# Altium project Power_Suply.PrjPcb
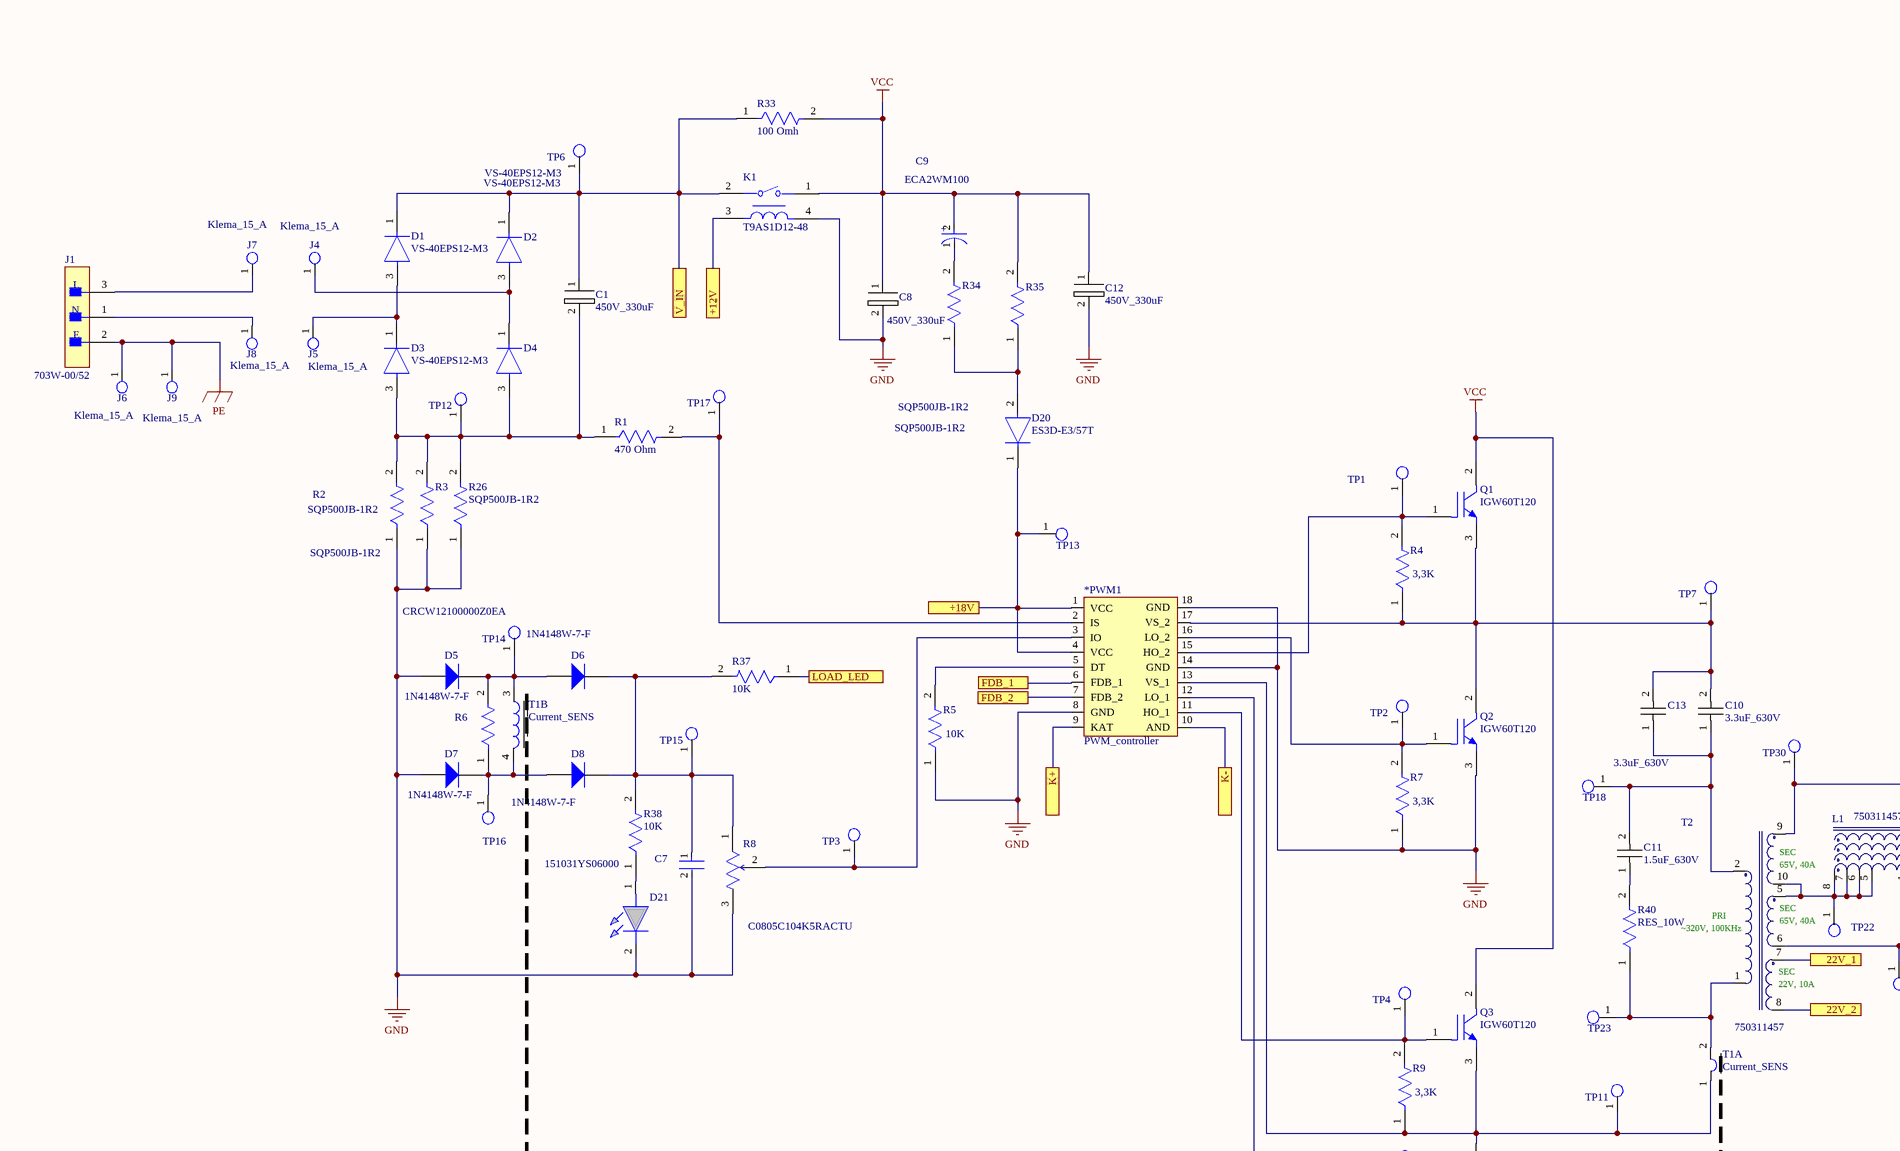
[diagram p0: Sheet1.SchDoc, top left]
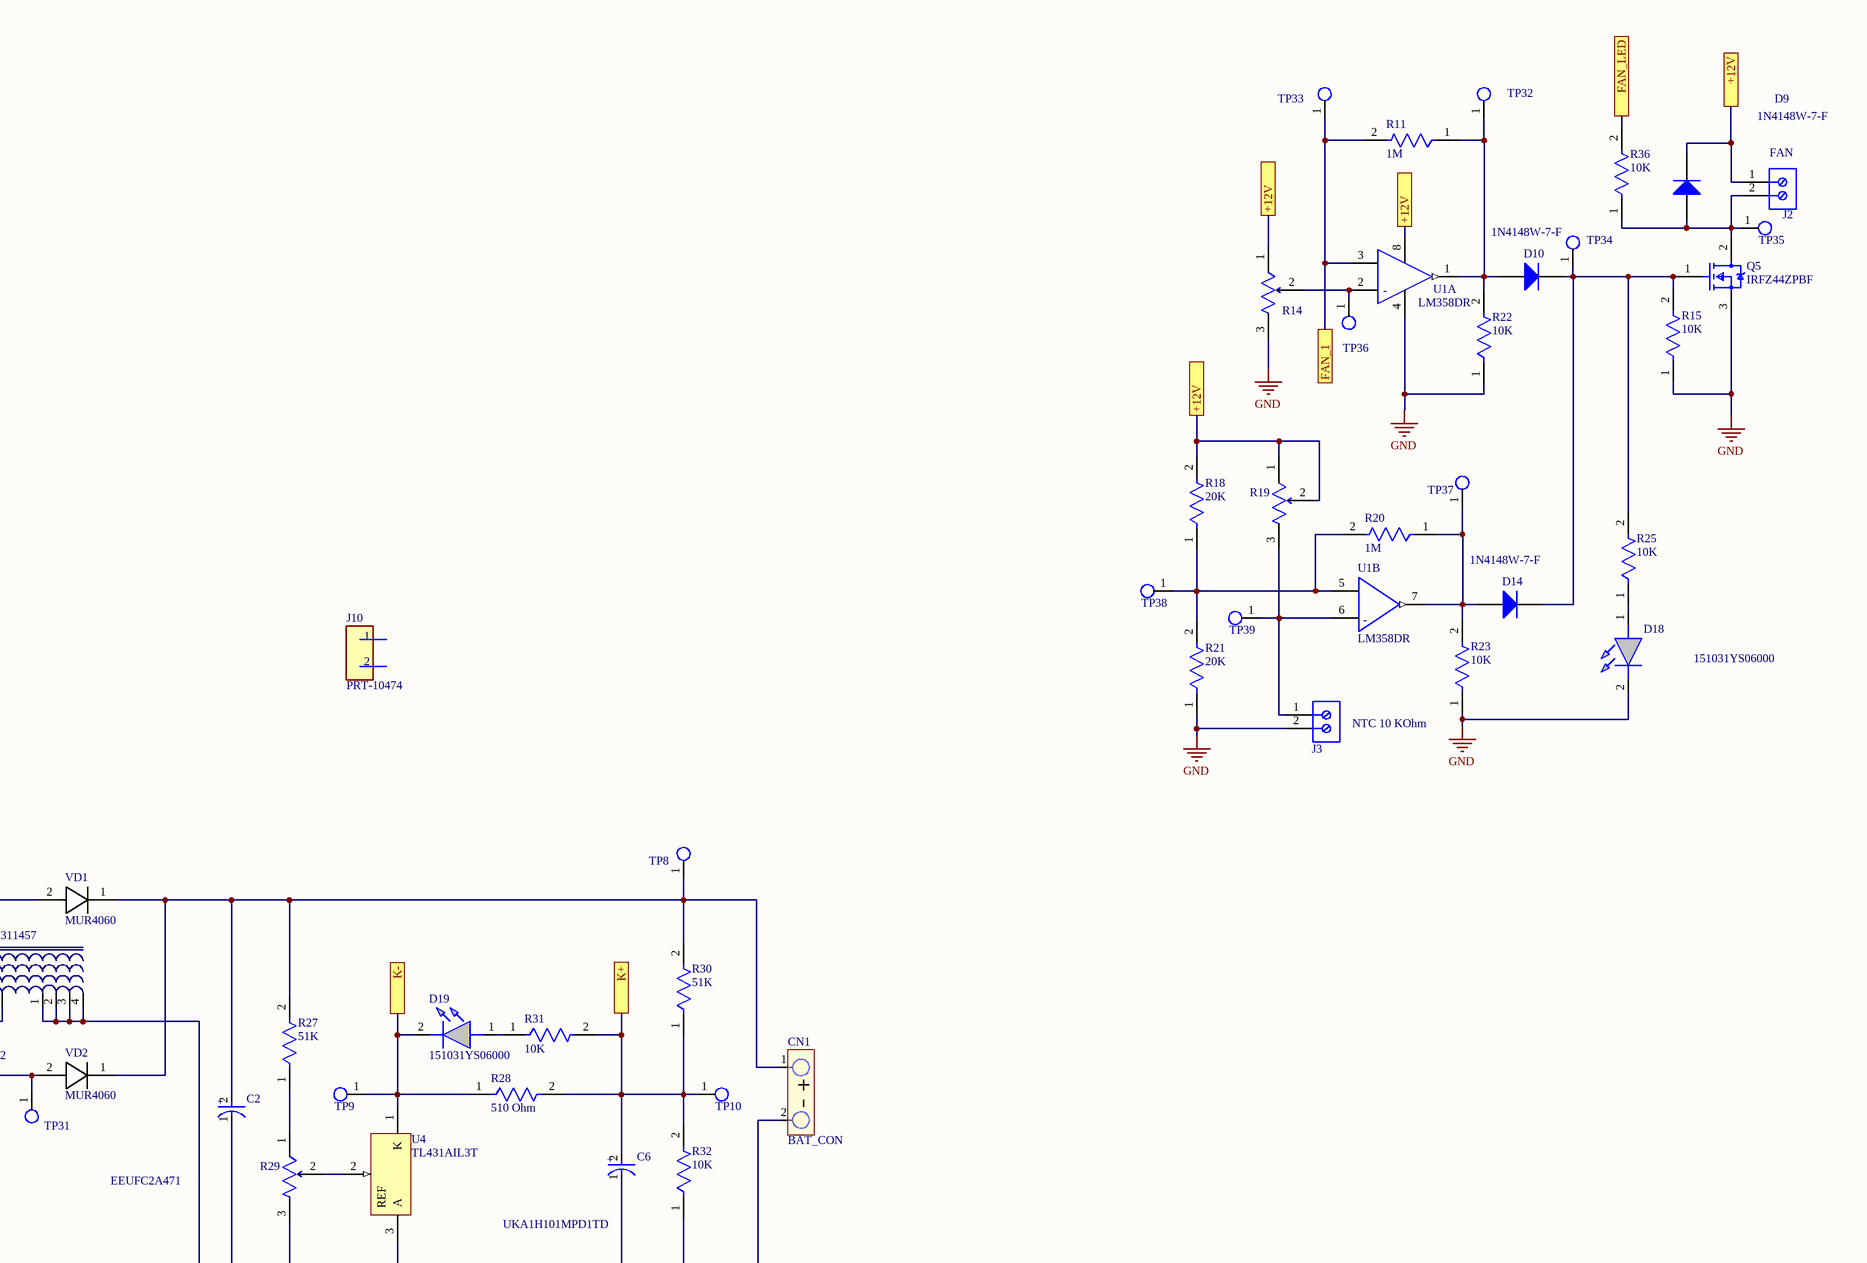
[diagram p1: Sheet1.SchDoc, top right]
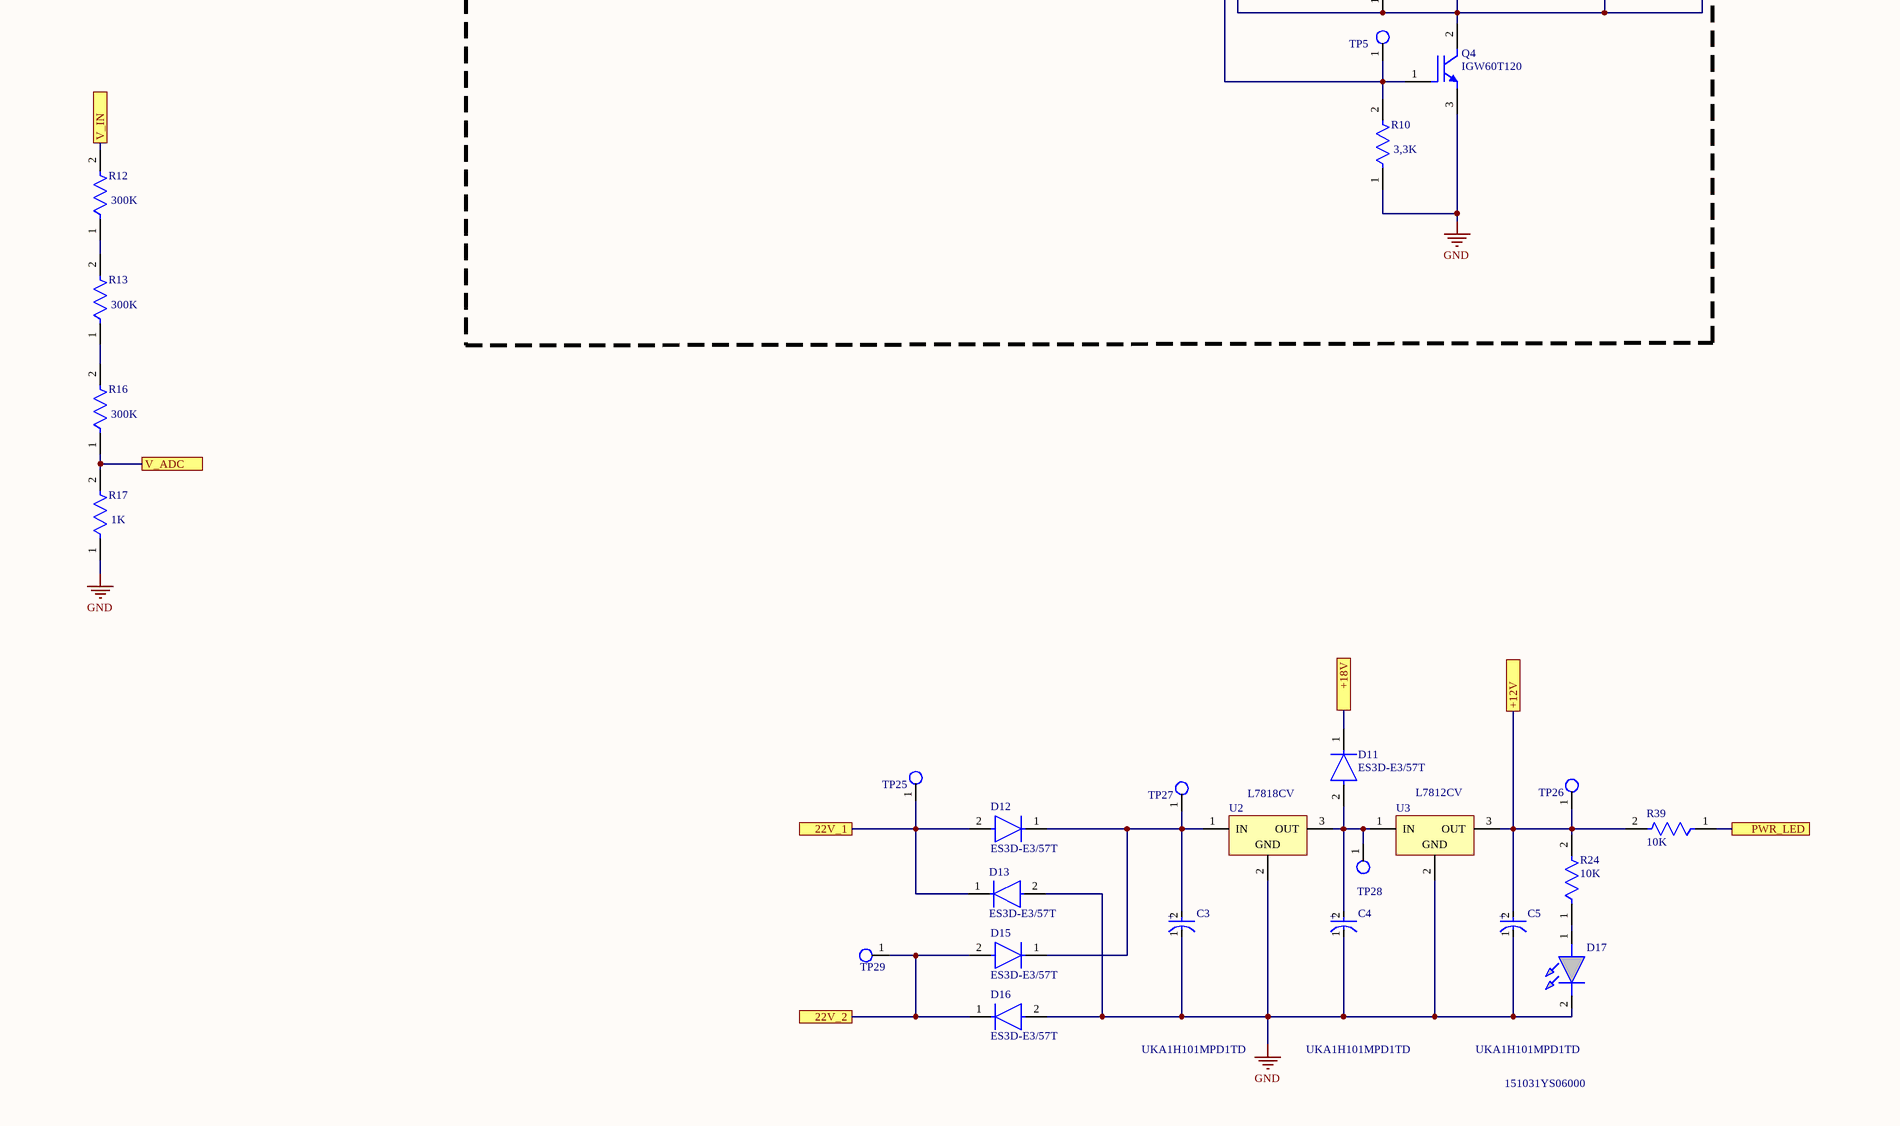
[diagram p2: Sheet1.SchDoc, bottom left]
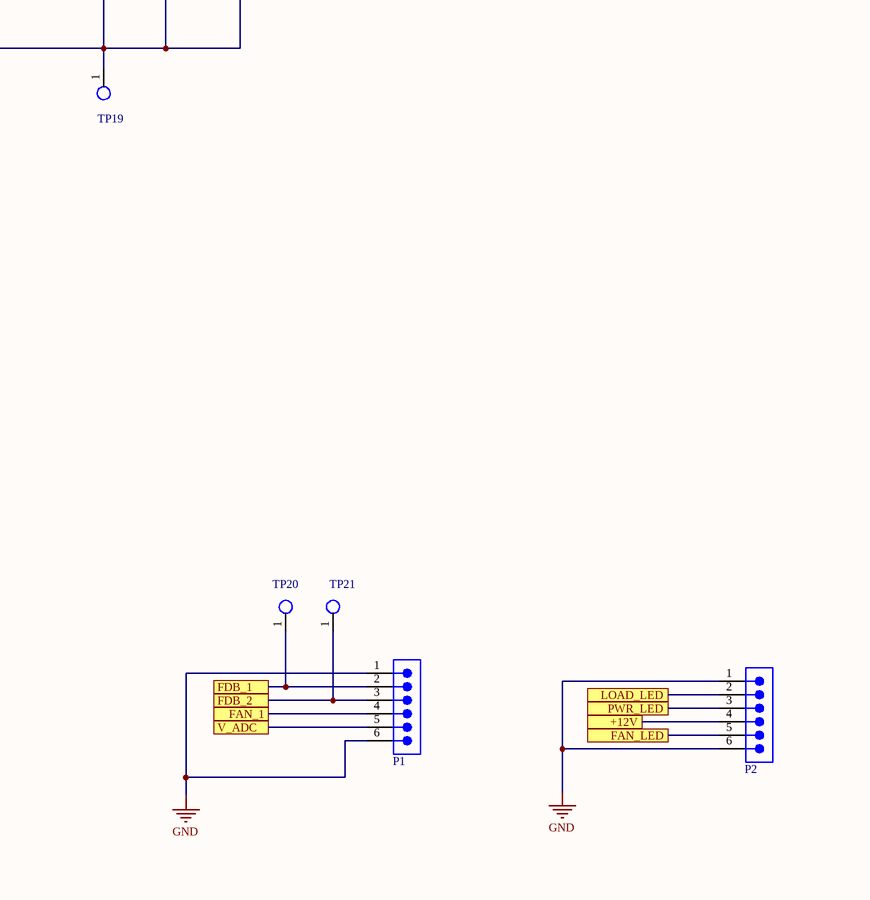
[diagram p3: Sheet1.SchDoc, bottom right]
1 sheet, 141 parts. Net scope: flat (ports and power ports of the same name join across sheets).
Board files: PCB2.PcbDoc, Катушки.PcbDoc

## Sheet Sheet1.SchDoc
size A1; SheetNumber: 1; SheetTotal: 1

### Parts
*PWM1  PWM_controller  [PWM_controller]
C1  450V_330uF  [CAP_450V_330uF]
C2  EEUFC2A471  [FP-RAD-TH-D_16_0_5-L_40_2-MFG]
C3  UKA1H101MPD1TD  [FP-UKA1H101MPD1TD-MFG]
C4  UKA1H101MPD1TD  [FP-UKA1H101MPD1TD-MFG]
C5  UKA1H101MPD1TD  [FP-UKA1H101MPD1TD-MFG]
C6  UKA1H101MPD1TD  [FP-UKA1H101MPD1TD-MFG]
C7  C0805C104K5RACTU  [FP-C0805C-DN-MFG]
C8  450V_330uF  [CAP_450V_470uF]
C9  ECA2WM100  [FP-RAD-TH-D_12_5_0_5-L_20-MFG]
C10  3.3uF_630V  [CAP_4.7uF_630V]
C11  1.5uF_630V  [CAP_1.5uf_400V]
C12  450V_330uF  [CAP_450V_470uF]
C13  3.3uF_630V  [CAP_4.7uF_630V]
CN1  BAT_CON  [Batarey_connector]
D1  VS-40EPS12-M3  [FP-96144-MFG]
D2  VS-40EPS12-M3  [FP-96144-MFG]
D3  VS-40EPS12-M3  [FP-96144-MFG]
D4  VS-40EPS12-M3  [FP-96144-MFG]
D5  1N4148W-7-F  [DIOD-SOD123-2_V]
D6  1N4148W-7-F  [DIOD-SOD123-2_V]
D7  1N4148W-7-F  [DIOD-SOD123-2_V]
D8  1N4148W-7-F  [DIOD-SOD123-2_V]
D9  1N4148W-7-F  [DIOD-SOD123-2_V]
D10  1N4148W-7-F  [DIOD-SOD123-2_V]
D11  ES3D-E3/57T  [FP-95402-MFG]
D12  ES3D-E3/57T  [FP-95402-MFG]
D13  ES3D-E3/57T  [FP-95402-MFG]
D14  1N4148W-7-F  [DIOD-SOD123-2_V]
D15  ES3D-E3/57T  [FP-95402-MFG]
D16  ES3D-E3/57T  [FP-95402-MFG]
D17  151031YS06000  [LED_BLUE]
D18  151031YS06000  [Wurth_Electronics_0_MFG]
D19  151031YS06000  [LED_Yellow]
D20  ES3D-E3/57T  [FP-95402-MFG]
D21  151031YS06000  [LED_GREEN]
J1  703W-00/52  [FP-703W-00-52-MFG]
J2  691137710002  [691137710002]  (value not drawn)
J3  691137710002  [691137710002]  (value not drawn)
J4  Klema_15_A  [Klema_PCB_15A]
J5  Klema_15_A  [Klema_PCB_15A]
J6  Klema_15_A  [Klema_PCB_15A]
J7  Klema_15_A  [Klema_PCB_15A]
J8  Klema_15_A  [Klema_PCB_15A]
J9  Klema_15_A  [Klema_PCB_15A]
J10  PRT-10474  [FP-PRT-10474-MFG]
K1  T9AS1D12-48  [NT90RNCS12CB]
L1  750311457  [Transformer]
P1  61900611121  [61900611121]  (value not drawn)
P2  61900611121  [61900611121]  (value not drawn)
Q1  IGW60T120  [TO-264-3]
Q2  IGW60T120  [TO-264-3]
Q3  IGW60T120  [TO-264-3]
Q4  IGW60T120  [TO-264-3]
Q5  IRFZ44ZPBF  [FP-PG-TO220-3-MFG]
R1  470 Ohm  [FP-CRCW0805-e3-MFG]
R2  SQP500JB-1R2  [FP-SQP500-MFG]
R3  SQP500JB-1R2  [FP-SQP500-MFG]
R4  3,3K  [FP-CRCW1210-e3-IPC_A]
R5  10K  [FP-CRCW1210-e3-IPC_A]
R6  CRCW12100000Z0EA  [FP-CRCW1210-e3-IPC_A]
R7  3,3K  [FP-CRCW1210-e3-IPC_A]
R8  3296W-1-202LF  [Bourns_3296W_MFG]  (value not drawn)
R9  3,3K  [FP-CRCW1210-e3-IPC_A]
R10  3,3K  [FP-CRCW1210-e3-IPC_A]
R11  1M  [FP-CRCW0805-e3-MFG]
R12  300K  [FP-CRCW1210-e3-IPC_A]
R13  300K  [FP-CRCW1210-e3-IPC_A]
R14  3296W-1-202LF  [Bourns_3296W_MFG]  (value not drawn)
R15  10K  [FP-CRCW0805-e3-MFG]
R16  300K  [FP-CRCW1210-e3-IPC_A]
R17  1K  [FP-CRCW1210-e3-IPC_A]
R18  20K  [FP-CRCW0805-e3-MFG]
R19  3296W-1-202LF  [Bourns_3296W_MFG]  (value not drawn)
R20  1M  [FP-CRCW0805-e3-MFG]
R21  20K  [FP-CRCW0805-e3-MFG]
R22  10K  [FP-CRCW0805-e3-MFG]
R23  10K  [FP-CRCW0805-e3-MFG]
R24  10K  [FP-CRCW0805-e3-MFG]
R25  10K  [FP-CRCW0805-e3-MFG]
R26  SQP500JB-1R2  [FP-SQP500-MFG]
R27  51K  [FP-CRCW0805-e3-MFG]
R28  510 Ohm  [FP-CRCW0805-e3-MFG]
R29  3296W-1-202LF  [Bourns_3296W_MFG]  (value not drawn)
R30  51K  [FP-CRCW0805-e3-MFG]
R31  10K  [FP-CRCW0805-e3-MFG]
R32  10K  [FP-CRCW0805-e3-MFG]
R33  100 Omh  [10W 3 Ohm]
R34  SQP500JB-1R2  [FP-SQP500-MFG]
R35  SQP500JB-1R2  [FP-SQP500-MFG]
R36  10K  [FP-CRCW0805-e3-MFG]
R37  10K  [FP-CRCW0805-e3-MFG]
R38  10K  [FP-CRCW0805-e3-MFG]
R39  10K  [FP-CRCW0805-e3-MFG]
R40  RES_10W  [10W 3 Ohm]
T1  Current_SENS  [Current_SENS]  (parts A,B of 2)
T2  750311457  [Transformer]
TP1  Test_Point_PCB  [Test_Point]  (value not drawn)
TP2  Test_Point_PCB  [Test_Point]  (value not drawn)
TP3  Test_Point_PCB  [Test_Point]  (value not drawn)
TP4  Test_Point_PCB  [Test_Point]  (value not drawn)
TP5  Test_Point_PCB  [Test_Point]  (value not drawn)
TP6  Test_Point_PCB  [Test_Point]  (value not drawn)
TP7  Test_Point_PCB  [Test_Point]  (value not drawn)
TP8  Test_Point_PCB  [Test_Point]  (value not drawn)
TP9  Test_Point_PCB  [Test_Point]  (value not drawn)
TP10  Test_Point_PCB  [Test_Point]  (value not drawn)
TP11  Test_Point_PCB  [Test_Point]  (value not drawn)
TP12  Test_Point_PCB  [Test_Point]  (value not drawn)
TP13  Test_Point_PCB  [Test_Point]  (value not drawn)
TP14  Test_Point_PCB  [Test_Point]  (value not drawn)
TP15  Test_Point_PCB  [Test_Point]  (value not drawn)
TP16  Test_Point_PCB  [Test_Point]  (value not drawn)
TP17  Test_Point_PCB  [Test_Point]  (value not drawn)
TP18  Test_Point_PCB  [Test_Point]  (value not drawn)
TP19  Test_Point_PCB  [Test_Point]  (value not drawn)
TP20  Test_Point_PCB  [Test_Point]  (value not drawn)
TP21  Test_Point_PCB  [Test_Point]  (value not drawn)
TP22  Test_Point_PCB  [Test_Point]  (value not drawn)
TP23  Test_Point_PCB  [Test_Point]  (value not drawn)
TP25  Test_Point_PCB  [Test_Point]  (value not drawn)
TP26  Test_Point_PCB  [Test_Point]  (value not drawn)
TP27  Test_Point_PCB  [Test_Point]  (value not drawn)
TP28  Test_Point_PCB  [Test_Point]  (value not drawn)
TP29  Test_Point_PCB  [Test_Point]  (value not drawn)
TP30  Test_Point_PCB  [Test_Point]  (value not drawn)
TP31  Test_Point_PCB  [Test_Point]  (value not drawn)
TP32  Test_Point_PCB  [Test_Point]  (value not drawn)
TP33  Test_Point_PCB  [Test_Point]  (value not drawn)
TP34  Test_Point_PCB  [Test_Point]  (value not drawn)
TP35  Test_Point_PCB  [Test_Point]  (value not drawn)
TP36  Test_Point_PCB  [Test_Point]  (value not drawn)
TP37  Test_Point_PCB  [Test_Point]  (value not drawn)
TP38  Test_Point_PCB  [Test_Point]  (value not drawn)
TP39  Test_Point_PCB  [Test_Point]  (value not drawn)
U1  LM358DR  [FP-D0008A-MFG]  (parts A,B of 2)
U2  L7818CV  [TO220]
U3  L7812CV  [TO220]
U4  TL431AIL3T  [SOT23-3_L]
VD1  MUR4060  [TO-247-2]
VD2  MUR4060  [TO-247-2]

### Ports
22V_1, 22V_2, +12V, +18V, FAN_1, FAN_LED, FDB_1, FDB_2, K+, K-, LOAD_LED, PWR_LED, V_ADC, V_IN

### Nets
GND: *PWM1.8(GND) *PWM1.14(GND) *PWM1.18(GND) C3.1(C) C4.1(C) C5.1(C) C7.2 C8.2 C12.2 D5.1(A) D7.1(A) D13.2(A) D16.2(A) D17.2(K) D18.2(K) D21.2(K) J3.2 K1.4 P1.1 P1.6 P2.1 P2.6 Q2.3(E) Q4.3(E) Q5.3(S) R2.1 R3.1 R5.1 R7.1 R8.3(CW) R10.1 R14.3(CW) R15.1 R17.1 R21.1 R22.1 R23.1 R26.1 U1.4(V-) U2.2(GND) U3.2(GND)
PE: J1.2(E) J6.1 J9.1
VCC: C8.1 C9.2(A) C12.1 K1.1 Q1.2(C) Q3.2(C) R33.2 R35.2
Net*PWM1_1: *PWM1.1(VCC) *PWM1.4(VCC) D11.1(C) D20.1(C) TP13.1(G9) ; port +18V
Net*PWM1_2: *PWM1.2(IS) R1.2 TP17.1(G9)
Net*PWM1_3: *PWM1.3(IO) R8.2(WIPER) TP3.1(G9)
Net*PWM1_5: *PWM1.5(DT) R5.2
Net*PWM1_6: *PWM1.6(FDB_1) P1.2 TP20.1(G9) ; port FDB_1
Net*PWM1_7: *PWM1.7(FDB_2) P1.3 TP21.1(G9) ; port FDB_2
Net*PWM1_9: *PWM1.9(KAT) C6.2(A) R28.2 R30.1 R31.2 R32.2 TP10.1(G9) ; port K+
Net*PWM1_10: *PWM1.10(AND) D19.2(K) R28.1 TP9.1(G9) U4.1(K) ; port K-
Net*PWM1_11: *PWM1.11(HO_1) Q3.1(G) R9.2 TP4.1(G9)
Net*PWM1_12: *PWM1.12(LO_1) Q4.1(G) R10.2 TP5.1(G9)
Net*PWM1_13: *PWM1.13(VS_1) Q3.3(E) Q4.2(C) R9.1 T1.1 TP11.1(G9)
Net*PWM1_15: *PWM1.15(HO_2) Q1.1(G) R4.2 TP1.1(G9)
Net*PWM1_16: *PWM1.16(LO_2) Q2.1(G) R7.2 TP2.1(G9)
Net*PWM1_17: *PWM1.17(VS_2) C10.2 C13.2 Q1.3(E) Q2.2(C) R4.1 TP7.1(G9)
NetC1_1: C1.1 D1.1(C) D2.1(C) K1.2 R12.2 R33.1 TP6.1(G9) ; port V_IN
NetC1_2: C1.2 D3.3(A) D4.3(A) R1.1 R2.2 R3.2 R26.2 TP12.1(G9)
NetC2_1: C2.1(C) C6.1(C) CN1.2(-) L1.1 L1.2 L1.3 L1.4 R29.3(CW) R32.1 TP19.1(G9) U4.3(A)
NetC2_2: C2.2(A) CN1.1(+) R27.2 R30.2 TP8.1(G9) VD1.1 VD2.1
NetC3_2: C3.2(A) D12.1(C) D15.1(C) TP27.1(G9) U2.1(IN)
NetC4_2: C4.2(A) D11.2(A) TP28.1(G9) U2.3(OUT) U3.1(IN)
NetC5_2: C5.2(A) D9.2(K) J2.1 K1.3 P2.4 R14.1(CCW) R18.2 R19.1(CCW) R19.2(WIPER) R24.2 R39.2 TP26.1(G9) U1.8(V+) U3.3(OUT) ; port +12V
NetC7_1: C7.1 D6.2(K) D8.2(K) R8.1(CCW) R37.2 R38.2 TP15.1(G9)
NetC9_1: C9.1(C) R34.2
NetC10_1: C10.1 C11.2 C13.1 T2.2 TP18.1(G9)
NetC11_1: C11.1 R40.2
NetD1_3: D1.3(A) D3.1(C) J5.1
NetD2_3: D2.3(A) D4.1(C) J4.1
NetD5_2: D5.2(K) D6.1(A) R6.2 T1.3 TP14.1(G9)
NetD7_2: D7.2(K) D8.1(A) R6.1 T1.4 TP16.1(G9)
NetD9_1: D9.1(A) J2.2 Q5.2(D) R36.1 TP35.1(G9)
NetD10_1: D10.1(A) R11.1 R22.2 TP32.1(G9) U1.1(1OUT)
NetD10_2: D10.2(K) D14.2(K) Q5.1(G) R15.2 R25.2 TP34.1(G9)
NetD12_2: D12.2(A) D13.1(C) T2.7 TP25.1(G9) ; port 22V_1
NetD14_1: D14.1(A) R20.1 R23.2 TP37.1(G9) U1.7(2OUT)
NetD15_2: D15.2(A) D16.1(C) T2.8 TP29.1(G9) ; port 22V_2
NetD17_1: D17.1(A) R24.1
NetD18_1: D18.1(A) R25.1
NetD19_1: D19.1(A) R31.1
NetD20_2: D20.2(A) R34.1 R35.1
NetD21_1: D21.1(A) R38.1
NetJ1_1: J1.1(N) J8.1
NetJ1_3: J1.3(L) J7.1
NetJ3_1: J3.1 R19.3(CW) TP39.1(G9) U1.6(IN2-)
NetL1_5: L1.5 L1.6 L1.7 L1.8 T2.5 T2.10 TP22.1(G9)
NetP1_4: P1.4 R11.2 TP33.1(G9) U1.3(IN1+) ; port FAN_1
NetP1_5: P1.5 R16.1 R17.2 ; port V_ADC
NetP2_2: P2.2 R37.1 ; port LOAD_LED
NetP2_3: P2.3 R39.1 ; port PWR_LED
NetP2_5: P2.5 R36.2 ; port FAN_LED
NetR12_1: R12.1 R13.2
NetR13_1: R13.1 R16.2
NetR14_2: R14.2(WIPER) TP36.1(G9) U1.2(IN1-)
NetR18_1: R18.1 R20.2 R21.2 TP38.1(G9) U1.5(IN2+)
NetR27_1: R27.1 R29.1(CCW)
NetR29_2: R29.2(WIPER) U4.2(REF)
NetR40_1: R40.1 T1.2 T2.1 TP23.1(G9)
NetT2_6: T2.6 TP31.1(G9) VD2.2
NetT2_9: T2.9 TP30.1(G9) VD1.2

### Notes on the sheet
- (near J2) FAN
- NTC 10 KOhm
- (in symbol CMP-1685-00009-2, part A) -
- (in symbol CMP-1685-00009-2, part B) -
- (in symbol CMP-05427-000270-1) +
- (in symbol CMP-05427-001155-1) +
- (in symbol CMP-12462-000027-1) +
- (in symbol CMP-157536-000001-1) 1; 2
- (in symbol Transformer) SEC; 65V, 40A; PRI; ~320V, 100KHz; 22V, 10A

### Library data of the parts
C1 C8 C12 = CAP_450V_330uF
C2 = CMP-05427-000270-1: Aluminum Electrolytic Capacitors (Radial Lead Type) AEC-Q200 Qualified 470uF ±20% 100V; Ripple Current: 1.92A; Impedance: 47mR; Polarity: Polar; Dielectric Material: Aluminium; Lead Diameter: 0.8mm; Life (Hours): 5000Hour; Leakage Current: 3uA; Radiation Hardening: No; REACH SVHC: No SVHC; Height: 40mm; Ratings: AEC-Q200; Max Operating Temperature: 105°C; RoHS Compliant: Yes; Construction: RADIAL; Lead Pitch: 7.5mm; Contact Plating: Tin; Voltage: 100V; Length: 40mm; Packaging: Bulk; Diameter: 16mm; Height - Seated (Max): 1.575inch; Voltage Rating (DC): 100V; Voltage Rating: 100V; ESR (Equivalent Series Resistance): 47mR; Case/Package: Radial; Lead Free: Lead Free; Tolerance: 20%; Series: FC; Capacitance: 470uF; Package Quantity: 100; Mount: Through Hole; Min Operating Temperature: -55°C; Termination: Radial
C3-C6 = CMP-12462-000027-1: CAP ALUM 100UF 20% 50V RADIAL; Life (Hours): 2000Hour; Ripple Current: 190mA; Leakage Current: 4uA; Termination: Radial; Mount: Through Hole; Length: 11.5mm; Series: KA; Case/Package: Radial; Package Quantity: 1; REACH SVHC: No SVHC; Height - Seated (Max): 0.512inch; Min Operating Temperature: -55°C; Packaging: Tape and Reel; Tolerance: 20%; Lead Pitch: 3.5mm; Voltage Rating (DC): 50V; Voltage Rating: 50V; Diameter: 8mm; Height: 11.5mm; Max Operating Temperature: 105°C; Capacitance: 100uF
C7 = CMP-2007-00279-2: CAP CER 0.1UF 50V X7R 0805; Manufacturer: KEMET; Value: 0.10 μF; Tolerance: 0.1; Temperature Coefficient: 30ppm/°C; Material: Ceramic; Manufacturer Part Number: C0805C104K5RACTU; Device Class L2: Capacitors; Temperature Range Low: -55°C; Voltage Rating: 50 V; Digikey Description: CAP CER 0.1UF 50V X7R 0805; Category: Cap; ComponentLink2Description: Datasheet; Octopart: https://octopart.com/c0805c104k5ractu-kemet-143926; RoHS: TRUE; ComponentLink2URL: https://content.kemet.com/datasheets/KEM_C1003_C0G_SMD.pdf; Temperature Characteristic: X7R; Temperature: -55°C to +125°C; Height: 0.88mm; Temperature Range High: +125°C; Device Class L1: Passive Components; Automotive: No; Lead Free: Yes; Ipc Land Pattern Name: CAPC200125X78; Device Class L3: Ceramic Capacitors; Mouser Description: Cap Ceramic 0.1uF 50V X7R 10% SMD 2.0 x 1.2 mm 125 C Paper T/R; Capacitance: 0.10 μF; Package: C0805C-DN
C9 = CMP-05427-001155-1: Aluminum Electrolytic Capacitors (Radial Lead Type) 10uF ±20% 450V; Ripple Current (AC): 130mA; Lead/Base Style: Straight; Leakage Current: 10uA; Lead Diameter: 0.6mm; Polarity: Polar; Life (Hours): 2000Hour; Dissipation Factor: 0.2%; Dielectric Material: Aluminium; Max Operating Temperature: 85°C; Capacitance: 10uF; Tolerance: 20%; Min Operating Temperature: -25°C; Height - Seated (Max): 0.866inch; Case/Package: Radial; Voltage Rating: 450V; Length: 20mm; Voltage: 450V; Diameter: 12.5mm; Number of Pins: 2; Lead Free: Lead Free; Packaging: Bulk; Mount: Through Hole; Series: M; RoHS Compliant: Yes; Ripple Current: 130mA; REACH SVHC: No SVHC; Voltage Rating (DC): 450V; Radiation Hardening: No; Termination: Radial; Lead Pitch: 5mm; Package Quantity: 200; Height: 20mm; Construction: RADIAL
C11 = 3.3uF_630V
CN1 = BAT_CON: Batarey_connection
D1-D4 = CMP-02540-000097-1: DIODE GP 1.2KV 40A TO247AC; Series: -; Case/Package: TO-247-2; Mount: Through Hole; Max Reverse Voltage (DC): 1.2kV; RoHS Compliant: Yes; Packaging: Rail/Tube; Average Rectified Current: 40A
D5-D10 D14 = CMP-2000-04932-2: Fast Switching Diode, 100 V, 0.15 A, -65 to 150 degC, 2-Pin?SOD123, RoHS, Tape and Reel; Recovery Time: 4ns; Brand: DiodesIncorporated; Unit Weight: 0.000353oz; Max Surge Current: 2A; Peak Reverse Voltage: 100V; Ir - Reverse Current: 1uA; Vf - Forward Voltage: 1.25V; Configuration: Single; If - Forward Current: 0.15A; Product Category: Diodes-GeneralPurpose,Power,Switching; Operating Temperature Range: -65Cto+150C; Packaging: Reel; Manufacturer URL: http://www.diodes.com/; Maximum Operating Temperature: +150C; Height: 1.25mm; Minimum Operating Temperature: -65C; Product: SwitchingDiodes; Package URL: http://www.diodes.com/datasheets/ds18004.pdf; Type: SwitchingDiode; Package Reference: SOD123-2; Width: 1.7mm; Datasheet URL: http://www.farnell.com/datasheets/1915529.pdf; Datasheet Version: Rev. 24-2, 10/2013; Series: 1N4148; Factory Pack Quantity: 3000; Length: 2.85mm; RoHS: True; Manufacturer: DiodesIncorporated; Mounting Style: SMD/SMT; Package / Case: SOD-123
D11-D13 D15 D16 D20 = CMP-02540-000021-1: DIODE GEN PURP 200V 3A DO214AB; Manufacturer: Vishay; Capacitance: 45pF; Value: 45pF; Max Surge Forward Current: 100A; Peak Reverse Current: 10uA; Standoff Height: 0mm; Max Junction Temp: +150°C; Height: 2.62mm; Category: Diode; Device Class L3: Rectifier Diodes; Manufacturer Part Number: ES3D-E3/57T; Temperature Range Low: -55°C; ComponentLink2URL: http://www.vishay.com/docs/88589/es3.pdf; Mouser Description: Rectifiers 3.0 Amp 200V 20ns; Package: 95402; Temperature Range High: +150°C; Octopart: https://octopart.com/es3d-e3%2F57t-vishay-39550290; Automotive: No; RoHS: TRUE; Forward Current: 3A; Temperature: -55°C to +150°C; Max Repetitive Reverse Voltage: 200V; Device Class L1: Discrete Semiconductors; Reverse Voltage: 200V; Lead Free: Yes; Digikey Description: DIODE GEN PURP 200V 3A DO214AB; Footprint Url: https://www.vishay.com/docs/95402/smc.pdf; ComponentLink2Description: Datasheet; Device Class L2: Diodes
D17-D19 D21 = 151031YS06000: WURTH ELEKTRONIK - 151031YS06000 - LED, Yellow, Through Hole, T-1 (3mm), 30 mA, 2 V, 590 nm; Geometry.Height: 5.5mm; Manufacturer_Name: Wurth Elektronik; Manufacturer_Part_Number: 151031YS06000; Mouser Part Number: 710-151031YS06000; Mouser Price/Stock: https://www.mouser.co.uk/ProductDetail/Wurth-Elektronik/151031YS06000?qs=LlUlMxKIyB3xSYYW%252BcuBiQ%3D%3D; Arrow Part Number: *; Arrow Price/Stock: *; Mouser Testing Part Number: *; Mouser Testing Price/Stock: *; Datasheet Link: https://katalog.we-online.de/led/datasheet/151031YS06000.pdf
J1 = CMP-64678-000001-1: PWR ENT RCPT IEC320-C14 PNL SLDR; Max Voltage Rating (AC): 250V; Approvals: UL; Current Rating: 15A; Number of Poles: 2; Fuse: No; Number of Positions: 3; Gender: Receptacle; Panel Thickness: 0.12inch; Pitch: 7mm; Voltage Rating (AC): 250V; Orientation: Right Angle; Contact Plating: Tin; Mount: Through Hole; Housing Material: Thermoplastic; Current: 15A; Termination: Solder; REACH SVHC: No SVHC; Lead Free: Lead Free; Voltage Rating: 250V; Number of Contacts: 3; Color: Black; Connector Type: Receptacle; Packaging: Bulk; Max Current Rating: 15A; Voltage Rating (DC): 250V; Package Quantity: 100
J2 J3 = 691137710002: WR-TBL Series 1377 Horizontal Entry, THT, pitch 5mm, 2p; Manufacturer: Wurth Elektronik; Modularity: No; Rated Current: 16A; Working Voltage: 300V; ComponentLink1Description: Website Link; ComponentLink1URL: https://www.we-online.com/redexpert/article/691137710002?ad; ComponentLink2Description: Datasheet Link; ComponentLink2URL: https://www.we-online.com/redexpert/spec/691137710002?ad; Manufacturer Part Number: 691137710002; Category: Terminal Blocks; Match Code: WR-TBL; Mount: Through Hole; Operating Temperature Max: 120°C; Operating Temperature Min: -30°C; Packaging: Box; Application: Pressure Clamp; Number of Pins: 2; Number of Rows: 1; Orientation: Horizontal; Pitch: 5mm
J10 = CMP-157536-000001-1: XT60 CONNECTORS MALE/FEMALE PAIR
K1 = CMP-03396-000117-1: RELAY GEN PURPOSE SPST 30A 48V; Coil Type: Non-Latching; Coil Power: 1W; Voltage Rating (AC): 277V; Approvals: UL; Relay Type: General Purpose; Coil Resistance: 2.304kR; Coil Current: 21mA; Life (Hours): 100000Hour; Operate Time: 15ms; Power Consumption: 4W; Depth: 27.43mm; Length: 32.5mm; RoHS Compliant: Yes; Height: 20.4mm; Max Operating Temperature: 85°C; Package Quantity: 50; Number of Pins: 4; Radiation Hardening: No; Termination: PCB; Contact Voltage Rating (AC): 277V; Width: 27.4mm; Current Rating: 30A; ELV: Non-Compliant; Packaging: Tray; Coil Voltage (DC): 48V; Lead Free: Lead Free; Contact Current Rating: 30A; Contact Material: Silver; Application(s): GENERAL PURPOSE; Throw Configuration: SPST; Weight: 0.918oz; Series: T9A; Release Time: 15ms; Min Operating Temperature: -55°C; Max Voltage Rating (AC): 277V; Mount: Through Hole
L1 = DROSEL: Manufacturer: Wuerth Elektronik; Ui: 36V; ComponentLink1Description: Manufacturer URL; ComponentLink2Description: Datasheet; ComponentLink1URL: http://www.we-online.com; PartNumber: 750311457; PackageReference: EP13; ComponentLink2URL: http://katalog.we-online.de/pbs/datasheet/750311457.pdf
P1 P2 = 61900611121: WR-WTB THT Male Vertical Locking Header, pitch 2.54mm, 6pins; Manufacturer: Wurth Elektronik; Contact Resistance: 20mΩ; Rated Current: 3A; Working Voltage: 250VAC; Withstanding Voltage: 1000VAC; ComponentLink1Description: Website Link; ComponentLink1URL: https://www.we-online.com/redexpert/article/61900611121?ad; ComponentLink2Description: Datasheet Link; ComponentLink2URL: https://www.we-online.com/redexpert/spec/61900611121?ad; Manufacturer Part Number: 61900611121; Category: Wire-to-Board Connectors; Match Code: WR-WTB; Mount: Through Hole; Operating Temperature Max: 105°C; Operating Temperature Min: -40°C; Packaging: Bag; Length: 15.24mm; Width: 5.8mm; Height: 11.5mm; Gender: Male; Number of Pins: 6; Number of Rows: 1; Orientation: Vertical; Pitch: 2.54mm
Q1-Q4 = CMP-1168-00042-1: Low Loss IGBT in TrenchStop and Fieldstop Technology, PG-TO247-3-44, Tube, Green; Manufacturer: Infineon; IC(max) @ 25 degC: 100 A; Switching Frequency: TRENCHSTOP 2-20kHz; Green: TRUE; VCE(sat) (typ): 2.3 V; VCE (max): 1,200 V; DatasheetVersion: Rev. 2.4; ComponentLink2Description: Datasheet; PackageDescription: 3-Pin Plastic (Green) Transistor Single Outline Package, Body 15.915 x 20.95 mm, Pitch 5.44 mm; PartNumber: IGW60T120; PackageVersion: Rev. 05, 07/2010; ComponentLink1Description: Manufacturer URL; ComponentLink3URL: http://www.infineon.com/dgdl/IDW10S120_Rev+2.pdf?folderId=db3a304314dca38901151224afae0c96&fileId=db3a304336724dc40136789691a04aa5; RevisionNote: Lost Devices pt2; Mounting Technology: Through Hole; ComponentLink3Description: Package Specification; ComponentLink1URL: http://www.infineon.com/; ComponentLink2URL: http://www.infineon.com/dgdl/IGW60T120_Rev2_4G.pdf?folderId=db3a304412b407950112b408e8c90004&fileId=db3a304412b407950112b428250e3d74; Packing: Tube; PackageReference: PG-TO247-3-44_A; Halogen-free: FALSE
Q5 = CMP-32901-000501-1: MOSFET N-CH 55V 51A TO220AB; Drain to Source Resistance: 13.9mR; Gate to Source Voltage (Vgs): 20V; Input Capacitance: 1.42nF; Max Power Dissipation: 80W; Turn-Off Delay Time: 33ns; Turn-On Delay Time: 14ns; Threshold Voltage: 4V; Packaging: Rail/Tube; Halogen Free: Halogen Free; Lead Free: Lead Free; Min Operating Temperature: -55°C; Width: 0.19inch; Length: 0.42inch; Height: 0.38inch; Max Operating Temperature: 175°C; Drain to Source Voltage (Vdss): 55V; RoHS Compliant: Yes; Continuous Drain Current (ID): 51A; Max Dual Supply Voltage: 55V; Rds On Max: 13.9mR; Power Dissipation: 80W; Mount: Through Hole; REACH SVHC: No SVHC; Drain to Source Breakdown Voltage: 55V; Number of Pins: 3; Case/Package: TO-220
R1 = CMP-2001-04908-2: RES Thick Film, 470Ω, 1%, 0.125W, 100ppm/°C, 0805; Resistance: 10kR; Voltage Rating (DC): 150V; Power Rating: 125mW; Weight: 0.000194oz; Package Quantity: 5000; Military Standard: Not; Max Operating Temperature: 155°C; Temperature Coefficient: 100ppm/°C; Contact Plating: Tin; Width: 1.25mm; Height: 0.45mm; Radiation Hardening: No; Tolerance: 1%; Min Operating Temperature: -55°C; Voltage Rating: 150V; Length: 2mm; Depth: 1.25mm; Termination: SMD/SMT; Packaging: Tape and Reel; Case/Package: 0805; Case Code (Metric): 2012; Lead Free: Lead Free; Case Code (Imperial): 0805; Composition: Thick Film
R2 R3 R26 R34 R35 = CMP-03413-000003-1: RES 1.2 OHM 5W 5% AXIAL; Manufacturer: Yageo; Temperature Coefficient: 300ppm/°C; Resistance: 1.2Ω; Value: 1.2Ω; Voltage Rating: 350V; Lead Free: Yes; Package: SQP500; Composition: Wirewound; Series: SQP; Temperature: -55°C to +155°C; Device Class L2: Resistors; Digikey Description: RES 1.2 OHM 5W 5% AXIAL; RoHS: TRUE; Device Class L3: Through-Hole Resistors; ComponentLink2Description: Datasheet; ComponentLink2URL: https://datasheet.ciiva.com/2723/yageolr-sqpnsp-2013-2723111.pdf; Temperature Range High: +155°C; Manufacturer Part Number: SQP500JB-1R2; Octopart: https://octopart.com/sqp500jb-1r2-yageo-1162571; Device Class L1: Passive Components; Tolerance: 5%; Height: 10mm; Category: Res; Ipc Land Pattern Name: RESAD2911W100L2350D1050; Automotive: No; Power Rating: 5W; Temperature Range Low: -55°C
R4 R7 R9 R10 = CMP-2005-01987-2: RES SMD 3,3K OHM 1% 1/2W 1992; Resistance: 0mR; Temperature Coefficient: 0ppm/°C; Max Power Dissipation: 500mW; Voltage Rating: 200V; Packaging: Tape and Reel; Max Operating Temperature: 155°C; REACH SVHC: No SVHC; Min Operating Temperature: -55°C; Package Quantity: 1; Length: 3.2mm; Case Code (Metric): 3225; Case/Package: 1210; Composition: Thick Film; Military Standard: Not; Contact Plating: Tin; Case Code (Imperial): 1210; Radiation Hardening: No; Depth: 2.5mm; Termination: SMD/SMT; Features: Automotive AEC-Q200; Width: 0.098inch; Mount: Surface Mount; Power Rating: 500mW; Weight: 0.000564oz; Number of Terminations: 2; Height: 0.55mm
R5 = CMP-2005-01987-2: RES SMD 10K OHM 1% 1/2W 1992; Resistance: 0mR; Temperature Coefficient: 0ppm/°C; Max Power Dissipation: 500mW; Voltage Rating: 200V; Packaging: Tape and Reel; Max Operating Temperature: 155°C; REACH SVHC: No SVHC; Min Operating Temperature: -55°C; Package Quantity: 1; Length: 3.2mm; Case Code (Metric): 3225; Case/Package: 1210; Composition: Thick Film; Military Standard: Not; Contact Plating: Tin; Case Code (Imperial): 1210; Radiation Hardening: No; Depth: 2.5mm; Termination: SMD/SMT; Features: Automotive AEC-Q200; Width: 0.098inch; Mount: Surface Mount; Power Rating: 500mW; Weight: 0.000564oz; Number of Terminations: 2; Height: 0.55mm
R6 = CMP-2005-01987-2: RES SMD 205K OHM 1% 1/2W 1992; Resistance: 0mR; Temperature Coefficient: 0ppm/°C; Max Power Dissipation: 500mW; Voltage Rating: 200V; Packaging: Tape and Reel; Max Operating Temperature: 155°C; REACH SVHC: No SVHC; Min Operating Temperature: -55°C; Package Quantity: 1; Length: 3.2mm; Case Code (Metric): 3225; Case/Package: 1210; Composition: Thick Film; Military Standard: Not; Contact Plating: Tin; Case Code (Imperial): 1210; Radiation Hardening: No; Depth: 2.5mm; Termination: SMD/SMT; Features: Automotive AEC-Q200; Width: 0.098inch; Mount: Surface Mount; Power Rating: 500mW; Weight: 0.000564oz; Number of Terminations: 2; Height: 0.55mm
R11 R20 = CMP-2001-04908-2: RES Thick Film, 1MΩ, 1%, 0.125W, 100ppm/°C, 0805; Resistance: 10kR; Voltage Rating (DC): 150V; Power Rating: 125mW; Weight: 0.000194oz; Package Quantity: 5000; Military Standard: Not; Max Operating Temperature: 155°C; Temperature Coefficient: 100ppm/°C; Contact Plating: Tin; Width: 1.25mm; Height: 0.45mm; Radiation Hardening: No; Tolerance: 1%; Min Operating Temperature: -55°C; Voltage Rating: 150V; Length: 2mm; Depth: 1.25mm; Termination: SMD/SMT; Packaging: Tape and Reel; Case/Package: 0805; Case Code (Metric): 2012; Lead Free: Lead Free; Case Code (Imperial): 0805; Composition: Thick Film
R12 R13 R16 = CMP-2005-01987-2: RES SMD 300K OHM 1% 1/2W 1992; Resistance: 0mR; Temperature Coefficient: 0ppm/°C; Max Power Dissipation: 500mW; Voltage Rating: 200V; Packaging: Tape and Reel; Max Operating Temperature: 155°C; REACH SVHC: No SVHC; Min Operating Temperature: -55°C; Package Quantity: 1; Length: 3.2mm; Case Code (Metric): 3225; Case/Package: 1210; Composition: Thick Film; Military Standard: Not; Contact Plating: Tin; Case Code (Imperial): 1210; Radiation Hardening: No; Depth: 2.5mm; Termination: SMD/SMT; Features: Automotive AEC-Q200; Width: 0.098inch; Mount: Surface Mount; Power Rating: 500mW; Weight: 0.000564oz; Number of Terminations: 2; Height: 0.55mm
R15 R22-R25 R31 R32 R36-R39 = CMP-2001-04908-2: RES Thick Film, 10KΩ, 1%, 0.125W, 100ppm/°C, 0805; Resistance: 10kR; Voltage Rating (DC): 150V; Power Rating: 125mW; Weight: 0.000194oz; Package Quantity: 5000; Military Standard: Not; Max Operating Temperature: 155°C; Temperature Coefficient: 100ppm/°C; Contact Plating: Tin; Width: 1.25mm; Height: 0.45mm; Radiation Hardening: No; Tolerance: 1%; Min Operating Temperature: -55°C; Voltage Rating: 150V; Length: 2mm; Depth: 1.25mm; Termination: SMD/SMT; Packaging: Tape and Reel; Case/Package: 0805; Case Code (Metric): 2012; Lead Free: Lead Free; Case Code (Imperial): 0805; Composition: Thick Film
R17 = CMP-2005-01987-2: RES SMD 1K OHM 1% 1/2W 1992; Resistance: 0mR; Temperature Coefficient: 0ppm/°C; Max Power Dissipation: 500mW; Voltage Rating: 200V; Packaging: Tape and Reel; Max Operating Temperature: 155°C; REACH SVHC: No SVHC; Min Operating Temperature: -55°C; Package Quantity: 1; Length: 3.2mm; Case Code (Metric): 3225; Case/Package: 1210; Composition: Thick Film; Military Standard: Not; Contact Plating: Tin; Case Code (Imperial): 1210; Radiation Hardening: No; Depth: 2.5mm; Termination: SMD/SMT; Features: Automotive AEC-Q200; Width: 0.098inch; Mount: Surface Mount; Power Rating: 500mW; Weight: 0.000564oz; Number of Terminations: 2; Height: 0.55mm
R18 R21 = CMP-2001-04908-2: RES Thick Film, 20KΩ, 1%, 0.125W, 100ppm/°C, 0805; Resistance: 10kR; Voltage Rating (DC): 150V; Power Rating: 125mW; Weight: 0.000194oz; Package Quantity: 5000; Military Standard: Not; Max Operating Temperature: 155°C; Temperature Coefficient: 100ppm/°C; Contact Plating: Tin; Width: 1.25mm; Height: 0.45mm; Radiation Hardening: No; Tolerance: 1%; Min Operating Temperature: -55°C; Voltage Rating: 150V; Length: 2mm; Depth: 1.25mm; Termination: SMD/SMT; Packaging: Tape and Reel; Case/Package: 0805; Case Code (Metric): 2012; Lead Free: Lead Free; Case Code (Imperial): 0805; Composition: Thick Film
R27 R30 = CMP-2001-04908-2: RES Thick Film, 51KΩ, 1%, 0.125W, 100ppm/°C, 0805; Resistance: 10kR; Voltage Rating (DC): 150V; Power Rating: 125mW; Weight: 0.000194oz; Package Quantity: 5000; Military Standard: Not; Max Operating Temperature: 155°C; Temperature Coefficient: 100ppm/°C; Contact Plating: Tin; Width: 1.25mm; Height: 0.45mm; Radiation Hardening: No; Tolerance: 1%; Min Operating Temperature: -55°C; Voltage Rating: 150V; Length: 2mm; Depth: 1.25mm; Termination: SMD/SMT; Packaging: Tape and Reel; Case/Package: 0805; Case Code (Metric): 2012; Lead Free: Lead Free; Case Code (Imperial): 0805; Composition: Thick Film
R28 = CMP-2001-04908-2: RES Thick Film, 510Ω, 1%, 0.125W, 100ppm/°C, 0805; Resistance: 10kR; Voltage Rating (DC): 150V; Power Rating: 125mW; Weight: 0.000194oz; Package Quantity: 5000; Military Standard: Not; Max Operating Temperature: 155°C; Temperature Coefficient: 100ppm/°C; Contact Plating: Tin; Width: 1.25mm; Height: 0.45mm; Radiation Hardening: No; Tolerance: 1%; Min Operating Temperature: -55°C; Voltage Rating: 150V; Length: 2mm; Depth: 1.25mm; Termination: SMD/SMT; Packaging: Tape and Reel; Case/Package: 0805; Case Code (Metric): 2012; Lead Free: Lead Free; Case Code (Imperial): 0805; Composition: Thick Film
R33 = RES_10W
T2 = Transformer: Manufacturer: Wuerth Elektronik; Ui: 36V; ComponentLink1Description: Manufacturer URL; ComponentLink2Description: Datasheet; ComponentLink1URL: http://www.we-online.com; PartNumber: 750311457; PackageReference: EP13; ComponentLink2URL: http://katalog.we-online.de/pbs/datasheet/750311457.pdf
TP1-TP23 TP25-TP39 = TP_PCB?: Test_Point
U1 = CMP-1685-00009-2: IC OPAMP GP 2 CIRCUIT 8SOIC; Output Current: 30mA; Min Dual Supply Voltage: 1.5V; Input Offset Voltage (Vos): 7mV; Power Supply Rejection Ratio (PSRR): 65dB; Unity Gain Bandwidth Product: 700kHz; Number of Channels: 2; Min Supply Voltage: 3V; Max Dual Supply Voltage: 16V; Dual Supply Voltage: 9V; Max Supply Voltage: 32V; Nominal Supply Current: 1.2mA; Slew Rate: 0.3V/µs; Input Bias Current: 250nA; Voltage Gain: 100dB; Operating Supply Current: 1mA; REACH SVHC: No SVHC; Package Quantity: 2500; Width: 3.91mm; Max Operating Temperature: 70°C; Min Operating Temperature: 0°C; Mount: Surface Mount; Length: 4.9mm; Radiation Hardening: No; Case/Package: SOIC; Lead Free: Lead Free; Number of Elements: 2; Packaging: Tape and Reel; Output Current per Channel: 30mA; Number of Circuits: 2; Bandwidth: 700kHz; Operating Supply Voltage: 16V; Gain Bandwidth Product: 700kHz; Number of Pins: 8; Number of Amplifiers: 2; Height: 1.58mm; Common Mode Rejection Ratio: 65dB; Contact Plating: Gold
U2 = CMP-0244-00426-1: Positive Voltage Regulator, 18V, 3-Pin TO-220; ComponentLink1Description: Manufacturer URL; ComponentLink3URL: http://www.st.com/internet/com/TECHNICAL_RESOURCES/TECHNICAL_LITERATURE/PACKAGE_INFORMATION/CD00004649.pdf; ComponentLink3Description: Package Specification; PackageReference: TO220; ComponentLink2Description: Datasheet; PackageVersion: ver3.0; ComponentLink2URL: http://www.st.com/internet/com/TECHNICAL_RESOURCES/TECHNICAL_LITERATURE/DATASHEET/CD00000444.pdf; ComponentLink1URL: http://www.st.com; DatasheetVersion: 16/11/2011; PackageDescription: TO, Thru-Hole, Vertical, Heatsink Mounted; 3 In-Line Leads; Pitch 2.54 mm
U3 = CMP-0244-00450-1: Positive Voltage Regulator, 12V, 3-Pin TO-220; PackageDescription: TO, Thru-Hole, Vertical, Heatsink Mounted; 3 In-Line Leads; Pitch 2.54 mm; ComponentLink3URL: http://www.st.com/internet/com/TECHNICAL_RESOURCES/TECHNICAL_LITERATURE/PACKAGE_INFORMATION/CD00004649.pdf; ComponentLink1URL: http://www.st.com; ComponentLink2Description: Datasheet; ComponentLink3Description: Package Specification; ComponentLink2URL: http://www.st.com/internet/com/TECHNICAL_RESOURCES/TECHNICAL_LITERATURE/DATASHEET/CD00000444.pdf; DatasheetVersion: 16/11/2011; PackageVersion: ver3.0; PackageReference: TO220; ComponentLink1Description: Manufacturer URL
U4 = CMP-0242-00060-1: Programmable Voltage Reference, 2.5 to 36V, 3-Pin SOT23-3, Tape and Reel; ComponentLink2Description: Datasheet; DatasheetVersion: Oct-2011; ComponentLink1URL: http://www.st.com; ComponentLink1Description: Manufacturer URL; PackageDescription: 3-Pin SOT-23 Package 0.95 mm Pitch, 2.4 mm Lead Span; PackageVersion: 2011; ComponentLink2URL: http://www.st.com/internet/com/TECHNICAL_RESOURCES/TECHNICAL_LITERATURE/DATASHEET/CD00000986.pdf; PackageReference: SOT23-3